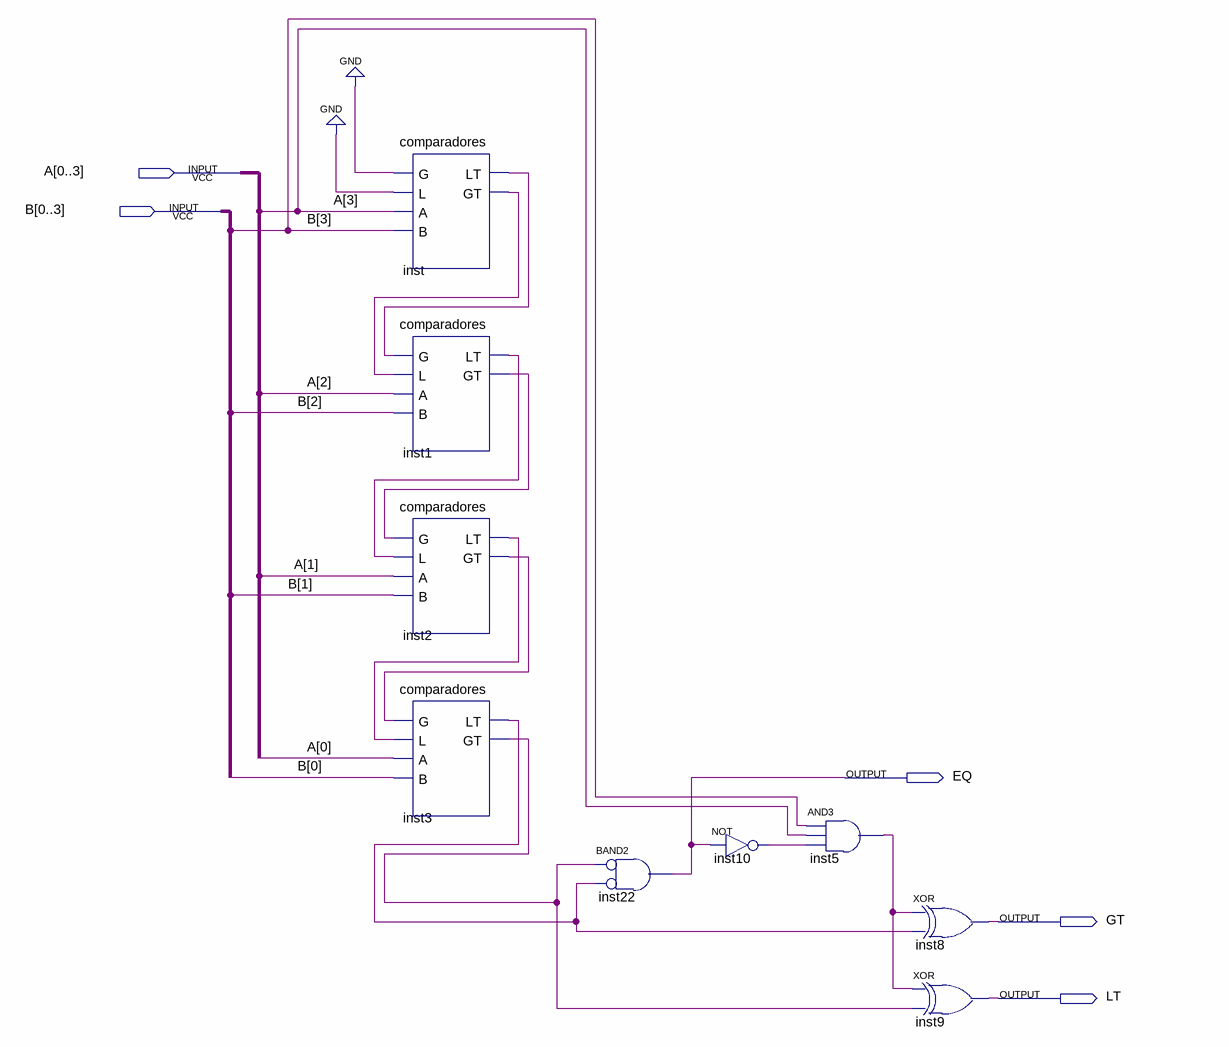
[diagram p0: schematic sheet]
// Quartus schematic comp4.bdf as structural Verilog: 9 symbols, 5 pins
module comp4 (
  input  [0:3] A,
  input  [0:3] B,
  output EQ,
  output GT,
  output LT
);

  wire inst1_gt, inst1_lt, inst2_gt, inst2_lt, inst3_gt, inst3_lt, inst5_out, inst10_out, inst_gt, inst_lt;

  comparadores inst (.G(1'b0), .L(1'b0), .A(A[3]), .B(B[3]), .LT(inst_lt), .GT(inst_gt));
  comparadores inst1 (.G(inst_lt), .L(inst_gt), .A(A[2]), .B(B[2]), .LT(inst1_lt), .GT(inst1_gt));
  comparadores inst2 (.G(inst1_gt), .L(inst1_lt), .A(A[1]), .B(B[1]), .LT(inst2_lt), .GT(inst2_gt));
  comparadores inst3 (.G(inst2_gt), .L(inst2_lt), .A(A[0]), .B(B[0]), .LT(inst3_lt), .GT(inst3_gt));
  and inst22 (EQ, ~inst3_gt, ~inst3_lt);  // BAND2
  not inst10 (inst10_out, EQ);
  and inst5 (inst5_out, B[3], A[3], inst10_out);
  xor inst8 (GT, inst5_out, inst3_lt);
  xor inst9 (LT, inst5_out, inst3_gt);
endmodule
